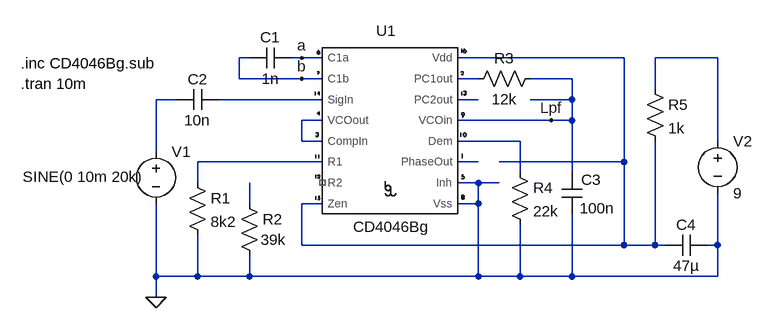
[diagram p0: schematic CD4046Bg-Test.asc]
CD4046Bg-Test.asc, the LTspice schematic file:
Version 4
SHEET 1 880 680
WIRE 0 80 -16 80
WIRE 80 80 64 80
WIRE 112 80 80 80
WIRE 576 80 320 80
WIRE 720 80 624 80
WIRE -16 112 -16 80
WIRE 80 112 -16 112
WIRE 112 112 80 112
WIRE 352 112 320 112
WIRE 496 112 432 112
WIRE 624 128 624 80
WIRE -112 144 -144 144
WIRE 112 144 -48 144
WIRE 352 144 320 144
WIRE 496 144 496 112
WIRE 496 144 432 144
WIRE 112 176 80 176
WIRE 464 176 320 176
WIRE 496 176 496 144
WIRE 496 176 464 176
WIRE 80 208 80 176
WIRE 112 208 80 208
WIRE 416 208 320 208
WIRE 720 208 720 80
WIRE -144 224 -144 144
WIRE 112 240 -80 240
WIRE 352 240 320 240
WIRE 576 240 576 80
WIRE 576 240 384 240
WIRE 416 256 416 208
WIRE 496 256 496 176
WIRE -80 272 -80 240
WIRE 352 272 320 272
WIRE 384 272 352 272
WIRE 0 304 0 272
WIRE 112 304 80 304
WIRE 352 304 352 272
WIRE 352 304 320 304
WIRE 80 368 80 304
WIRE 576 368 576 240
WIRE 576 368 80 368
WIRE 624 368 624 208
WIRE 624 368 576 368
WIRE 640 368 624 368
WIRE 720 368 720 288
WIRE 720 368 704 368
WIRE -144 416 -144 304
WIRE -80 416 -80 352
WIRE -80 416 -144 416
WIRE 0 416 0 384
WIRE 0 416 -80 416
WIRE 352 416 352 304
WIRE 352 416 0 416
WIRE 416 416 416 336
WIRE 416 416 352 416
WIRE 496 416 496 320
WIRE 496 416 416 416
WIRE 720 416 720 368
WIRE 720 416 496 416
WIRE -144 448 -144 416
FLAG -144 448 0
FLAG 80 80 a
FLAG 80 112 b
FLAG 464 176 Lpf
SYMBOL CD4000\\CD4046Bg 224 224 R0
SYMATTR InstName U1
SYMBOL voltage -144 208 R0
WINDOW 3 -205 55 Left 2
WINDOW 123 0 0 Left 2
WINDOW 39 0 0 Left 2
SYMATTR Value SINE(0 10m 20k)
SYMATTR InstName V1
SYMBOL voltage 720 192 R0
WINDOW 123 0 0 Left 2
WINDOW 39 0 0 Left 2
SYMATTR InstName V2
SYMATTR Value 9
SYMBOL res 448 96 R90
WINDOW 0 0 56 VBottom 2
WINDOW 3 32 56 VTop 2
SYMATTR InstName R3
SYMATTR Value 12k
SYMBOL cap 64 64 R90
WINDOW 0 0 32 VBottom 2
WINDOW 3 32 32 VTop 2
SYMATTR InstName C1
SYMATTR Value 1n
SYMBOL cap 512 320 R180
WINDOW 0 -29 53 Left 2
WINDOW 3 -50 9 Left 2
SYMATTR InstName C3
SYMATTR Value 100n
SYMBOL res -96 256 R0
SYMATTR InstName R1
SYMATTR Value 8k2
SYMBOL res 608 112 R0
SYMATTR InstName R5
SYMATTR Value 1k
SYMBOL res -16 288 R0
WINDOW 3 33 72 Left 2
SYMATTR Value 39k
SYMATTR InstName R2
SYMBOL cap -48 128 R90
WINDOW 0 0 32 VBottom 2
WINDOW 3 32 32 VTop 2
SYMATTR InstName C2
SYMATTR Value 10n
SYMBOL res 400 240 R0
SYMATTR InstName R4
SYMATTR Value 22k
SYMBOL cap 640 352 M90
WINDOW 0 0 32 VBottom 2
WINDOW 3 32 32 VTop 2
SYMATTR InstName C4
SYMATTR Value 47µ
SYMATTR SpiceLine V=25 Irms=8.06 Rser=0.00577565 Lser=0
TEXT -352 120 Left 2 !.tran 10m
TEXT -352 88 Left 2 !.inc CD4046Bg.sub

The netlist it stands for:
* CD4046Bg-Test.asc
XU1 a b N007 0 N009 NC_01 N005 Lpf N001 0 N008 N003 N006 N010 N007 N001 CD4046Bg  ; pins C1a C1b CompIn Inh R1 R2 SigIn VCOin Vdd Vss Dem PC1out PC2out PhaseOut VCOout Zen
V1 N004 0 SINE(0 10m 20k)
V2 N002 0 9
R3 Lpf N003 12k
C1 a b 1n
C3 0 Lpf 100n
R1 N009 0 8k2
R5 N002 N001 1k
R2 N011 0 39k
C2 N005 N004 10n
R4 N008 0 22k
C4 N001 0 47µ V=25 Irms=8.06 Rser=0.00577565 Lser=0
.tran 10m
.inc CD4046Bg.sub
.lib CD4046Bg.sub
.backanno
.end